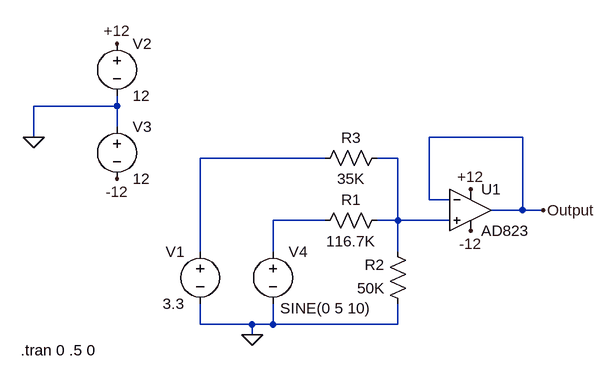
[diagram p0: schematic inputx.asc]
inputx.asc, the LTspice schematic file:
Version 4
SHEET 1 880 680
WIRE -240 16 -240 0
WIRE -240 16 -368 16
WIRE -240 48 -240 16
WIRE -368 64 -368 16
WIRE 384 64 240 64
WIRE 80 96 -112 96
WIRE 192 96 160 96
WIRE 240 160 240 64
WIRE 272 160 240 160
WIRE 384 176 384 64
WIRE 384 176 336 176
WIRE 416 176 384 176
WIRE 80 192 0 192
WIRE 192 192 192 96
WIRE 192 192 160 192
WIRE 272 192 192 192
WIRE -112 240 -112 96
WIRE 0 240 0 192
WIRE 192 240 192 192
WIRE -112 352 -112 320
WIRE -32 352 -112 352
WIRE 0 352 0 320
WIRE 0 352 -32 352
WIRE 192 352 192 320
WIRE 192 352 0 352
WIRE -32 368 -32 352
FLAG -368 64 0
FLAG -240 128 -12
FLAG -240 -80 +12
FLAG 304 144 +12
FLAG 304 208 -12
FLAG -32 368 0
FLAG 416 176 Output
SYMBOL OpAmps\\AD823 304 112 R0
SYMATTR InstName U1
SYMBOL voltage -112 224 M0
WINDOW 123 0 0 Left 0
WINDOW 39 0 0 Left 0
SYMATTR InstName V1
SYMATTR Value 3.3
SYMBOL voltage -240 -96 R0
WINDOW 123 0 0 Left 0
WINDOW 39 0 0 Left 0
SYMATTR InstName V2
SYMATTR Value 12
SYMBOL voltage -240 32 R0
WINDOW 123 0 0 Left 0
WINDOW 39 0 0 Left 0
SYMATTR InstName V3
SYMATTR Value 12
SYMBOL voltage 0 224 R0
WINDOW 3 11 103 Left 2
WINDOW 123 0 0 Left 0
WINDOW 39 0 0 Left 0
SYMATTR Value SINE(0 5 10)
SYMATTR InstName V4
SYMBOL res 176 176 R90
WINDOW 0 0 56 VBottom 2
WINDOW 3 32 56 VTop 2
SYMATTR InstName R1
SYMATTR Value 116.7K
SYMBOL res 208 336 R180
WINDOW 0 36 76 Left 2
WINDOW 3 36 40 Left 2
SYMATTR InstName R2
SYMATTR Value 50K
SYMBOL res 176 80 R90
WINDOW 0 0 56 VBottom 2
WINDOW 3 32 56 VTop 2
SYMATTR InstName R3
SYMATTR Value 35K
TEXT -388 392 Left 2 !.tran 0 .5 0

The netlist it stands for:
* inputx.asc
XU1 N002 Output +12 -12 Output AD823  ; pins In+ In- V+ V- OUT
V1 N001 0 3.3
V2 +12 0 12
V3 0 -12 12
V4 N003 0 SINE(0 5 10)
R1 N002 N003 116.7K
R2 0 N002 50K
R3 N002 N001 35K
.tran 0 .5 0
.lib ADI.lib
.backanno
.end